# Altium schematic sheet Switch.SchDoc: Debounced switch
size A4; Author: L. Sartory; Organization: L. Sartory; Address2: Nixie clock; Address3: with GPS synchronization; DocumentNumber: 12; Revision: B1; SheetNumber: 12; SheetTotal: 12
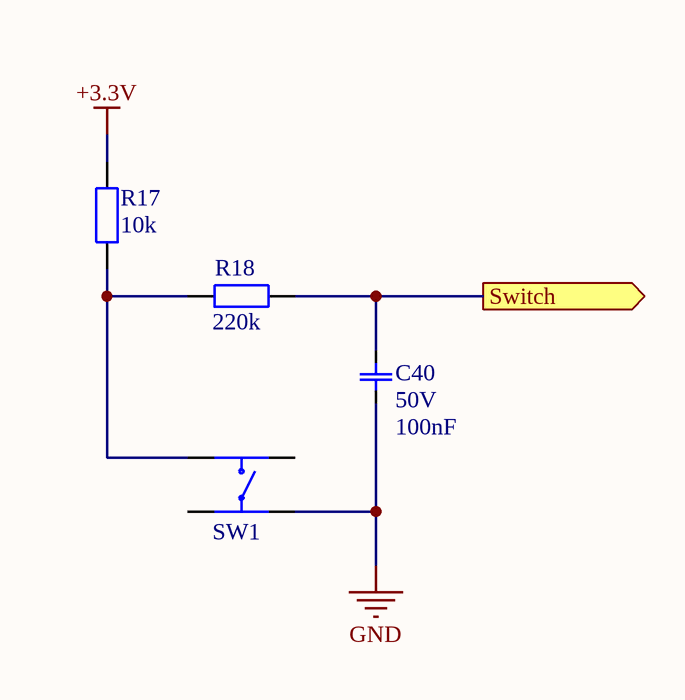
[diagram p0: Switch.SchDoc]

## Parts
C40  Voltage: 50V  [MLCC_0603]  (hidden comment: 100nF)
R17  10k  [RES0805]
R18  220k  [RES0805]
SW1  KSEK43GLFS  [KSEK43GLFS]  (value not drawn)

## Ports
Switch (out)

## Nets
+3.3V: R17.2
GND: C40.2 SW1.3
Switch: C40.1 R18.2 ; port Switch
NetR17_1: R17.1 R18.1 SW1.1

Not connected (* = marked no-connect by the designer): SW1 2 4

## Notes on the sheet
- Title
- Size:
- Date:
- A4
- Number:
- Time:
- Revision:
- Sheet
- of
- File:
- (in symbol 10k 0805) Text
- (in symbol 220k 0805) Text

## Library data of the parts
C40 = MLCC 100nF 50V 0603: Value: 100nF
R17 = 10k 0805: Chip resistor 10k 0805; Value: 10k
R18 = 220k 0805: Chip resistor 220k 0805; Value: 220k
SW1 = KSEK43GLFS: Low Profile Tact Switch, 4.3 mm height